# Altium schematic sheet IDE_CF.SchDoc: IDE Connector
size A3; Revision: 06; SheetNumber: 2; SheetTotal: 7; Organization: Altium Limited.; Address1: Level 3, 12a Rodborough Rd; Address2: Frenchs Forest 2086; Address3: NSW; Address4: AUSTRALIA
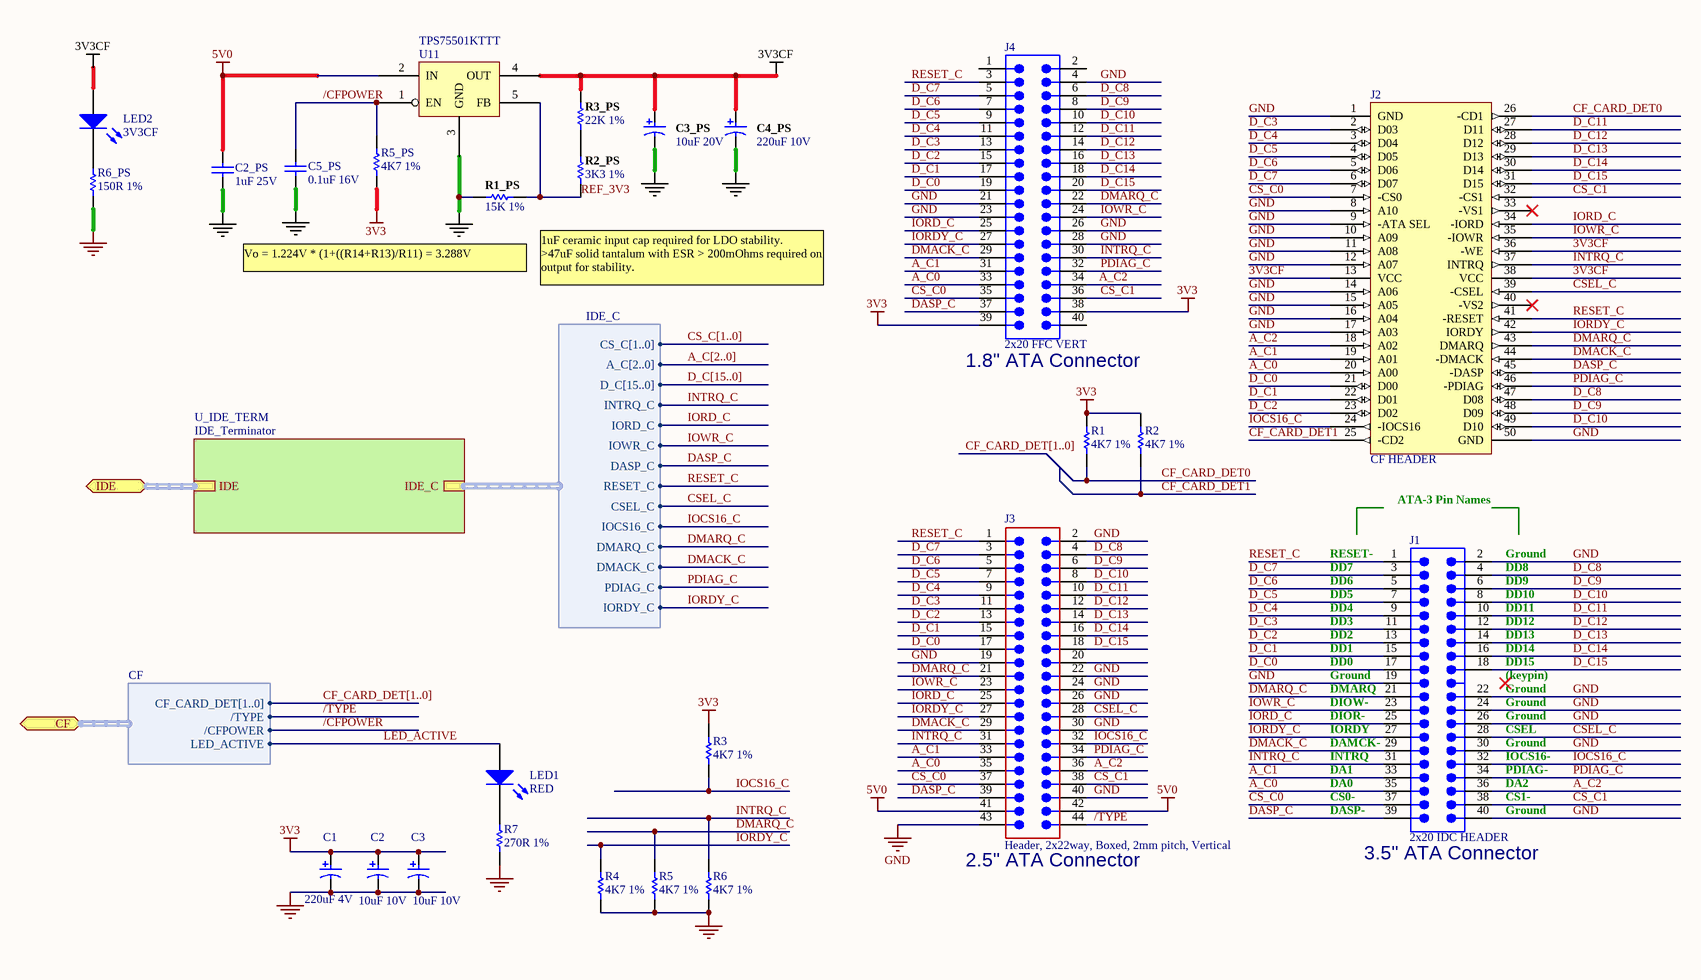
[diagram p0: IDE_CF.SchDoc]

## Parts
C1  220uF 4V  [CAPC7343-STAR]
C2  10uF 10V  [CAPC3528-STAR]
C2_PS  1uF 25V  [CAPC3216-STAR]
C3  10uF 10V  [CAPC3528-STAR]
C3_PS  10uF 20V  [CAPC3528-STAR]
C4_PS  220uF 10V  [CAPC7343-STAR]
C5_PS  0.1uF 16V  [CAPC1005-STAR]
J1  2x20 IDC HEADER  [918540x324]
J2  CF HEADER  [CF_SM0_635-6H50B]
J3  Header, 2x22way, Boxed, 2mm pitch, Vertical  [HDR2X22-2mm]
J4  2x20 FFC VERT  [FFC40-05-VERT]
LED1  RED  [LED2012-STAR]
LED2  3V3CF  [LED2012-STAR]
R1  4K7 1%  [RESC1005-STAR]
R1_PS  15K 1%  [RESC1005-STAR]
R2  4K7 1%  [RESC1005-STAR]
R2_PS  3K3 1%  [RESC1005-STAR]
R3  4K7 1%  [RESC1005-STAR]
R3_PS  22K 1%  [RESC1005-STAR]
R4  4K7 1%  [RESC1005-STAR]
R5  4K7 1%  [RESC1005-STAR]
R5_PS  4K7 1%  [RESC1005-STAR]
R6  4K7 1%  [RESC1005-STAR]
R6_PS  150R 1%  [RESC1005-STAR]
R7  270R 1%  [RESC1005-STAR]
U11  TPS75501KTTT  [TO-263]

## Sub-sheets
U_IDE_TERM = IDE_Terminator: IDE (harness IDE), IDE_C (harness IDE_C)

## Ports
CF (harness CF), IDE (harness IDE)

## Harnesses
IDE_C: CS_C[1..0], A_C[2..0], D_C[15..0], INTRQ_C, IORD_C, IOWR_C, DASP_C, RESET_C, CSEL_C, IOCS16_C, DMARQ_C, DMACK_C, PDIAG_C, IORDY_C
CF: CF_CARD_DET[1..0], /TYPE, /CFPOWER, LED_ACTIVE

## Nets
3V3: C1.1 C2.1 C3.1 J4.38 J4.39 R1.1 R2.1 R3.1 R5_PS.2
3V3CF: C3_PS.1 C4_PS.1 J2.13(VCC) J2.36(-WE) J2.38(VCC) LED2.1(A) R3_PS.2 U11.4(OUT)
5V0: C2_PS.1 J3.41 J3.42 U11.2(IN)
GND: C1.2 C2.2 C2_PS.2 C3.2 C3_PS.2 C4_PS.2 C5_PS.2 J1.2 J1.19 J1.22 J1.24 J1.26 J1.30 J1.40 J2.1(GND) J2.8(A10) J2.9(-ATA_SEL) J2.10(A09) J2.11(A08) J2.12(A07) J2.14(A06) J2.15(A05) J2.16(A04) J2.17(A03) J2.50(GND) J3.2 J3.19 J3.22 J3.24 J3.26 J3.30 J3.40 J3.43 J4.4 J4.21 J4.23 J4.26 J4.28 R1_PS.1 R4.2 R5.2 R6.2 R6_PS.2 R7.1 U11.3(GND)
/CFPOWER: C5_PS.1 R5_PS.1 U11.1(EN) ; port CF./CFPOWER
/TYPE: J3.44 ; port CF./TYPE
A_C0: J1.35 J2.20(A00) J3.35 J4.33
A_C1: J1.33 J2.19(A01) J3.33 J4.31
A_C2: J1.36 J2.18(A02) J3.36 J4.34
CF_CARD_DET0: J2.26(-CD1) R1.2
CF_CARD_DET1: J2.25(-CD2) R2.2
CS_C0: J1.37 J2.7(-CS0) J3.37 J4.35
CS_C1: J1.38 J2.32(-CS1) J3.38 J4.36
CSEL_C: J1.28 J2.39(-CSEL) J3.28 ; sheet U_IDE_TERM/IDE_C.CSEL_C
D_C0: J1.17 J2.21(D00) J3.17 J4.19
D_C1: J1.15 J2.22(D01) J3.15 J4.17
D_C2: J1.13 J2.23(D02) J3.13 J4.15
D_C3: J1.11 J2.2(D03) J3.11 J4.13
D_C4: J1.9 J2.3(D04) J3.9 J4.11
D_C5: J1.7 J2.4(D05) J3.7 J4.9
D_C6: J1.5 J2.5(D06) J3.5 J4.7
D_C7: J1.3 J2.6(D07) J3.3 J4.5
D_C8: J1.4 J2.47(D08) J3.4 J4.6
D_C9: J1.6 J2.48(D09) J3.6 J4.8
D_C10: J1.8 J2.49(D10) J3.8 J4.10
D_C11: J1.10 J2.27(D11) J3.10 J4.12
D_C12: J1.12 J2.28(D12) J3.12 J4.14
D_C13: J1.14 J2.29(D13) J3.14 J4.16
D_C14: J1.16 J2.30(D14) J3.16 J4.18
D_C15: J1.18 J2.31(D15) J3.18 J4.20
DASP_C: J1.39 J2.45(-DASP) J3.39 J4.37 ; sheet U_IDE_TERM/IDE_C.DASP_C
DMACK_C: J1.29 J2.44(-DMACK) J3.29 J4.29 ; sheet U_IDE_TERM/IDE_C.DMACK_C
DMARQ_C: J1.21 J2.43(DMARQ) J3.21 J4.22 R5.1 ; sheet U_IDE_TERM/IDE_C.DMARQ_C
INTRQ_C: J1.31 J2.37(INTRQ) J3.31 J4.30 R6.1 ; sheet U_IDE_TERM/IDE_C.INTRQ_C
IOCS16_C: J1.32 J2.24(-IOCS16) J3.32 R3.2 ; sheet U_IDE_TERM/IDE_C.IOCS16_C
IORD_C: J1.25 J2.34(-IORD) J3.25 J4.25 ; sheet U_IDE_TERM/IDE_C.IORD_C
IORDY_C: J1.27 J2.42(IORDY) J3.27 J4.27 R4.1 ; sheet U_IDE_TERM/IDE_C.IORDY_C
IOWR_C: J1.23 J2.35(-IOWR) J3.23 J4.24 ; sheet U_IDE_TERM/IDE_C.IOWR_C
LED_ACTIVE: LED1.1(A) ; port CF.LED_ACTIVE
PDIAG_C: J1.34 J2.46(-PDIAG) J3.34 J4.32 ; sheet U_IDE_TERM/IDE_C.PDIAG_C
REF_3V3: R1_PS.2 R2_PS.1 U11.5(FB)
RESET_C: J1.1 J2.41(-RESET) J3.1 J4.3 ; sheet U_IDE_TERM/IDE_C.RESET_C
NetLED1_2: LED1.2(K) R7.2
NetLED2_2: LED2.2(K) R6_PS.1
NetR2_PS_2: R2_PS.2 R3_PS.1

Not connected (* = marked no-connect by the designer): J2 33(-VS1)* 40(-VS2)*; J3 20; J4 1 2 40

## Buses and harness runs
bus A_C[2..0]
bus CF_CARD_DET[1..0]
bus CS_C[1..0]
bus D_C[15..0]
harness port IDE = sheet U_IDE_TERM/IDE

## Notes on the sheet
- Vo = 1.224V * (1+((R14+R13)/R11) = 3.288V
- 1uF ceramic input cap required for LDO stability.
  >47uF solid tantalum with ESR > 200mOhms required on output for stability.
- (near J4) 1.8" ATA Connector
- (near J1) RESET-
- ATA-3 Pin Names
- (near J1) Ground
- DD7
- DD3
- DD4
- DD5
- DD6
- (near J1) DD8
- (near J1) DD9
- (near J1) DD10
- (near J1) DD11
- (near J1) DD12
- DD0
- DD1
- DD2
- (near J1) DMARQ
- (near J1) DD13
- (near J1) DD14
- (near J1) DD15
- (near J1) (keypin)
- (near J1) INTRQ
- (near J1) DAMCK-
- (near J1) IORDY
- (near J1) DIOR-
- (near J1) DIOW-
- (near J1) CSEL
- (near J1) IOCS16-
- (near J1) DASP-
- CS0-
- DA0
- DA1
- (near J1) PDIAG-
- (near J1) DA2
- (near J1) CS1-
- (near J3) 2.5" ATA Connector
- (near J1) 3.5" ATA Connector
- Sheet Title
- Project Title
- Size:
- Date:
- A3
- Assy:
- Time:
- Revision:
- Sheet
- of
- File:

## Library data of the parts
C1 = D-101-0003: Capacitor, Tantalum, 220uF-4V-MCCT-D (7343); Polarity: Polarized; Tolerance: %; Capacitance: 220 uF; Category: Capacitor; Mounting Technology: Surface Mount; Rated Voltage: 4 V; Status: Production; Technology: Tantalum
C2 C3 = D-101-0009: Capacitor, Tantalum, 10uF 10V MCCT-B (3528); Polarity: Polarized; Tolerance: %; Capacitance: 10 uF; Category: Capacitor; Mounting Technology: Surface Mount; Rated Voltage: 10 V; Status: Deprecated; Technology: Tantalum
C2_PS = D-101-0027: Capacitor, Ceramic, 1uF 10% 25V 1206 (3216) X7R; Polarity: Non-Polarized; Capacitance: 1 uF; Dielectric: X7R; Mounting Technology: Surface Mount; Rated Voltage: 25 V; Status: Production; Technology: Ceramic; Tolerance: 10 %; Category: Capacitor
C3_PS = D-101-0007: Capacitor, Tantalum, 10uF 10% 20V MCCT-B (3528); Polarity: Polarized; Category: Capacitor; Capacitance: 10 uF; Mounting Technology: Surface Mount; Rated Voltage: 20 V; Status: Production; Technology: Tantalum; Tolerance: 10 %
C4_PS = D-101-0088: Capacitor, Tantalum, 220uF 10% 10V MCCT-D (7343-31); Polarity: Polarized; Category: Capacitor; Capacitance: 220 uF; Mounting Technology: Surface Mount; Rated Voltage: 10 V; Status: Unreleased; Technology: Tantalum; Tolerance: 10 %
C5_PS = D-101-0080: Capacitor, Ceramic, 0.1uF 10% 16V 0402 (1005) X7R; Polarity: Non-Polarized; Capacitance: 0.1 uF; Dielectric: X7R; Mounting Technology: Surface Mount; Rated Voltage: 16 V; Status: Production; Technology: Ceramic; Tolerance: 10 %; Category: Capacitor
J1 = D-300-0011: Header, Box 2 x 20 Pin Vertical 2.54mm Pitch; Max Current: mA; Category: Connector; Connector type: Header; Mounting Technology: Surface Mount; Status: Production
J2 = D-300-0029: Connector, Compact Flash Card Adaptor Top-side; Max Current: mA; Category: Connector; Connector type: Header; Mounting Technology: Surface Mount; Pin Count: 50; Status: Production
J3 = D-300-0004: Max Current: mA; Connector type: Header; Mounting Technology: Through-Hole; Pin Count: 44; Status: Production; Category: Connector
J4 = D-300-0057: Header FFC, 2x20 pin Vertical, 0.5mm; Connector type: Straight; Max Current: mA; Mounting Technology: Surface Mount; Pin Count: 40; Status: Unreleased; Category: Connector
LED1 = D-153-0003: LED, Red 0805 (2013) HSMH-C170; Brightness: 17.0 mcd; Peak Wave Length: 639 nm; Category: LED; Color: N/A; Mounting Technology: Surface Mount; Status: Production
LED2 = D-153-0004: LED, Green 0805 (2012) KP-2012SGD; Brightness: 12.5 mcd; Peak Wave Length: 565 nm; Category: LED; Color: N/A; Mounting Technology: Surface Mount; Status: Production
R1-R5 R5_PS R6 = D-100-0088: Resistor, 4K7 1% 0402 (1005); Power Rating: 63 mW; Resistance: 4.7 K; Category: Resistor; Mounting Technology: Surface Mount; Status: Production; Tolerance: 1 %
R1_PS = D-100-0125: Resistor, 15K 1% 0402 (1005); Power Rating: 63 mW; Category: Resistor; Mounting Technology: Surface Mount; Resistance: 15 K; Status: Production; Tolerance: 1 %
R2_PS = D-100-0098: Resistor, 3K3 1% 0402 (1005); Power Rating: 63 mW; Resistance: 3.3 K; Category: Resistor; Mounting Technology: Surface Mount; Status: Production; Tolerance: 1 %
R3_PS = D-100-0114: Resistor, 22K 1% 0402 (1005); Power Rating: mW; Category: Resistor; Mounting Technology: Surface Mount; Resistance: 22 K; Status: Production; Tolerance: 1 %
R6_PS = D-100-0005: Resistor, 150R 1% 0402 (1005); Power Rating: 63 mW; Category: Resistor; Mounting Technology: Surface Mount; Resistance: 150 R; Status: Unreleased; Tolerance: 1 %
R7 = D-100-0111: Resistor, 270R 1% 0402 (1005); Power Rating: 63 mW; Category: Resistor; Mounting Technology: Surface Mount; Resistance: 270 R; Status: Production; Tolerance: 1 %
U11 = D-204-0014: TPS75501KTTT, 5A, Low Dropout, Adjustable, Linear Voltage Regulator, TO-263; Max Input Voltage: 6 V; Max Output Voltage: 5.5 V; Min Input Voltage: 1 V; Supply Voltage: mV; Max Output Current: 5 A; Min Output Voltage: 1 V; Mounting Technology: Surface Mount; Status: Production; Temperature Range: -40 to +125; Category: IC-Power